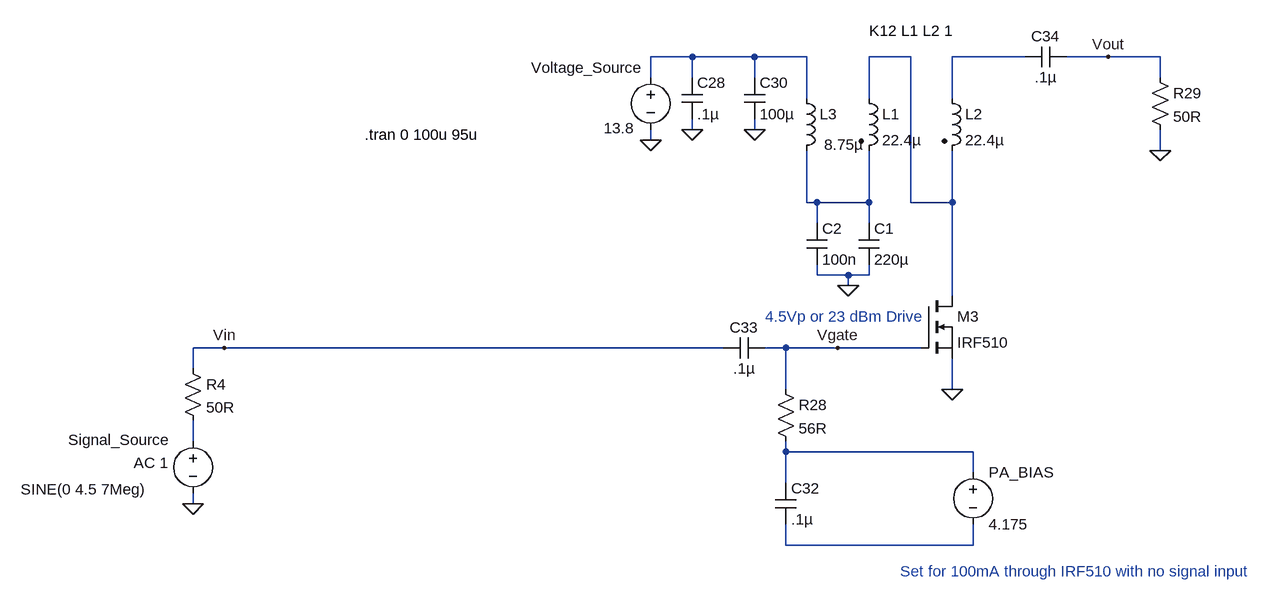
[diagram p0: schematic Power Amp IRF510 Stage.asc]
Power Amp IRF510 Stage.asc, the LTspice schematic file:
Version 4
SHEET 1 2548 2288
WIRE 512 1392 448 1392
WIRE 608 1392 512 1392
WIRE 688 1392 608 1392
WIRE 848 1392 784 1392
WIRE 1024 1392 912 1392
WIRE 1152 1392 1088 1392
WIRE 1232 1392 1152 1392
WIRE 448 1424 448 1392
WIRE 512 1424 512 1392
WIRE 608 1424 608 1392
WIRE 1232 1424 1232 1392
WIRE 688 1456 688 1392
WIRE 784 1456 784 1392
WIRE 912 1456 912 1392
WIRE 512 1504 512 1488
WIRE 608 1504 608 1488
WIRE 448 1520 448 1504
WIRE 1232 1536 1232 1504
WIRE 688 1616 688 1536
WIRE 704 1616 688 1616
WIRE 784 1616 784 1536
WIRE 784 1616 704 1616
WIRE 848 1616 848 1392
WIRE 912 1616 912 1536
WIRE 912 1616 848 1616
WIRE 704 1648 704 1616
WIRE 784 1648 784 1616
WIRE 704 1728 704 1712
WIRE 752 1728 704 1728
WIRE 784 1728 784 1712
WIRE 784 1728 752 1728
WIRE 752 1744 752 1728
WIRE 912 1760 912 1616
WIRE -208 1840 -256 1840
WIRE 560 1840 -208 1840
WIRE 656 1840 624 1840
WIRE 736 1840 656 1840
WIRE 864 1840 736 1840
WIRE -256 1872 -256 1840
WIRE 656 1904 656 1840
WIRE 912 1904 912 1856
WIRE -256 1984 -256 1952
WIRE 656 2000 656 1984
WIRE 944 2000 656 2000
WIRE 944 2032 944 2000
WIRE 656 2048 656 2000
WIRE -256 2080 -256 2064
WIRE 656 2144 656 2112
WIRE 944 2144 944 2112
WIRE 944 2144 656 2144
FLAG -256 2080 0
FLAG 512 1504 0
FLAG 608 1504 0
FLAG 1232 1536 0
FLAG 912 1904 0
FLAG -208 1840 Vin
FLAG 736 1840 Vgate
FLAG 1152 1392 Vout
FLAG 448 1520 0
FLAG 752 1744 0
SYMBOL voltage -256 1968 R0
WINDOW 3 -265 90 Left 2
WINDOW 123 -91 49 Left 2
WINDOW 0 -192 14 Left 2
WINDOW 39 0 0 Left 2
SYMATTR Value SINE(0 4.5 7Meg)
SYMATTR Value2 AC 1
SYMATTR InstName Signal_Source
SYMBOL res -272 1856 R0
SYMATTR InstName R4
SYMATTR Value 50R
SYMBOL nmos 864 1760 R0
SYMATTR InstName M3
SYMATTR Value IRF510
SYMBOL voltage 448 1408 R0
WINDOW 123 0 0 Left 2
WINDOW 39 0 0 Left 2
WINDOW 0 -184 1 Left 2
WINDOW 3 -72 94 Left 2
SYMATTR InstName Voltage_Source
SYMATTR Value 13.8
SYMBOL cap 496 1424 R0
SYMATTR InstName C28
SYMATTR Value .1µ
SYMBOL ind2 768 1440 R0
SYMATTR InstName L1
SYMATTR Value 22.4µ
SYMATTR Type ind
SYMBOL ind2 896 1440 R0
SYMATTR InstName L2
SYMATTR Value 22.4µ
SYMATTR Type ind
SYMBOL ind 672 1440 R0
WINDOW 3 43 87 Left 2
SYMATTR InstName L3
SYMATTR Value 8.75µ
SYMBOL cap 592 1424 R0
SYMATTR InstName C30
SYMATTR Value 100µ
SYMBOL res 640 1888 R0
SYMATTR InstName R28
SYMATTR Value 56R
SYMBOL cap 640 2048 R0
SYMATTR InstName C32
SYMATTR Value .1µ
SYMBOL voltage 944 2016 R0
WINDOW 123 0 0 Left 2
WINDOW 39 0 0 Left 2
SYMATTR InstName PA_BIAS
SYMATTR Value 4.175
SYMBOL cap 624 1824 R90
WINDOW 0 0 32 VBottom 2
WINDOW 3 32 32 VTop 2
SYMATTR InstName C33
SYMATTR Value .1µ
SYMBOL cap 1088 1376 R90
WINDOW 0 0 32 VBottom 2
WINDOW 3 32 32 VTop 2
SYMATTR InstName C34
SYMATTR Value .1µ
SYMBOL res 1216 1408 R0
SYMATTR InstName R29
SYMATTR Value 50R
SYMBOL cap 768 1648 R0
SYMATTR InstName C1
SYMATTR Value 220µ
SYMBOL cap 688 1648 R0
SYMATTR InstName C2
SYMATTR Value 100n
TEXT 8 1512 Left 2 !.tran 0 100u 95u
TEXT 784 1352 Left 2 !K12 L1 L2 1
TEXT 832 2184 Left 2 ;Set for 100mA through IRF510 with no signal input
TEXT 624 1792 Left 2 ;4.5Vp or 23 dBm Drive

The netlist it stands for:
* Power Amp IRF510 Stage.asc
V§Signal_Source N005 0 SINE(0 4.5 7Meg) AC 1
R4 Vin N005 50R
M3 N002 Vgate 0 0 IRF510
Voltage_Source N001 0 13.8
C28 N001 0 .1µ
L1 N002 N004 22.4µ
L2 N003 N002 22.4µ
L3 N001 N004 8.75µ
C30 N001 0 100µ
R28 Vgate N006 56R
C32 N006 N007 .1µ
V§PA_BIAS N006 N007 4.175
C33 Vgate Vin .1µ
C34 Vout N003 .1µ
R29 Vout 0 50R
C1 N004 0 220µ
C2 N004 0 100n
.model NMOS NMOS
.model PMOS PMOS
.lib standard.mos
.tran 0 100u 95u
K12 L1 L2 1
* Set for 100mA through IRF510 with no signal input
* 4.5Vp or 23 dBm Drive
.backanno
.end